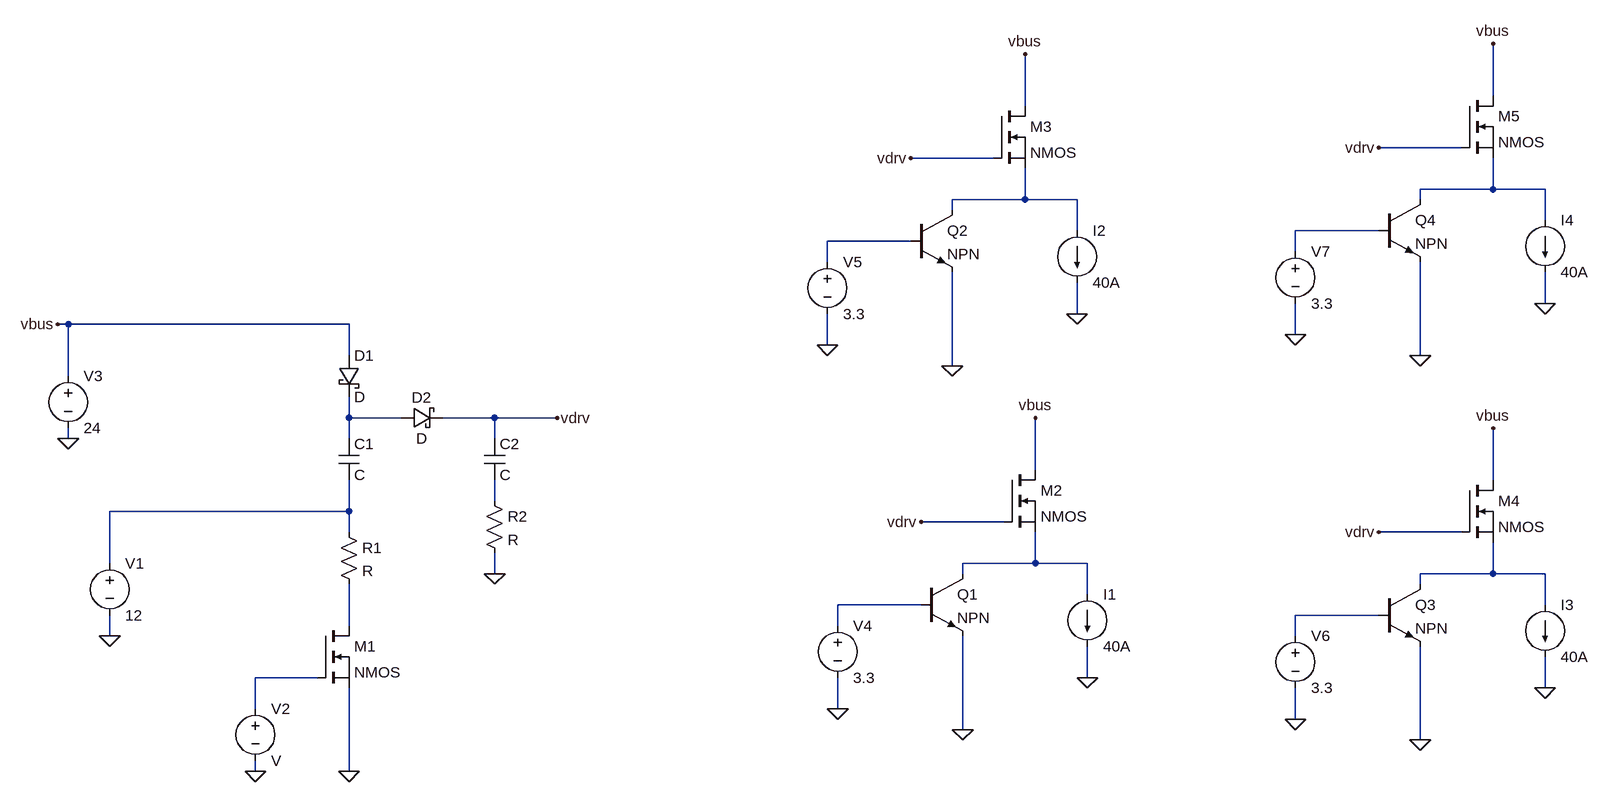
[diagram p0: schematic full_sim.asc]
full_sim.asc, the LTspice schematic file:
Version 4.1
SHEET 1 2216 680
WIRE 2064 -656 2064 -736
WIRE 1344 -640 1344 -720
WIRE 2016 -576 1888 -576
WIRE 1296 -560 1168 -560
WIRE 2064 -512 2064 -560
WIRE 2064 -512 1952 -512
WIRE 2144 -512 2064 -512
WIRE 1344 -496 1344 -544
WIRE 1344 -496 1232 -496
WIRE 1424 -496 1344 -496
WIRE 1952 -496 1952 -512
WIRE 1232 -480 1232 -496
WIRE 2144 -464 2144 -512
WIRE 1424 -448 1424 -496
WIRE 1888 -448 1760 -448
WIRE 1168 -432 1040 -432
WIRE 1760 -416 1760 -448
WIRE 1040 -400 1040 -432
WIRE 2144 -336 2144 -384
WIRE 1424 -320 1424 -368
WIRE -128 -304 -144 -304
WIRE 304 -304 -128 -304
WIRE 1760 -288 1760 -336
WIRE 1040 -272 1040 -320
WIRE 304 -256 304 -304
WIRE 1952 -256 1952 -400
WIRE 1232 -240 1232 -384
WIRE -128 -224 -128 -304
WIRE 304 -160 304 -192
WIRE 384 -160 304 -160
WIRE 528 -160 448 -160
WIRE 624 -160 528 -160
WIRE -128 -128 -128 -144
WIRE 304 -128 304 -160
WIRE 528 -128 528 -160
WIRE 1360 -80 1360 -160
WIRE 2064 -64 2064 -144
WIRE 528 -32 528 -64
WIRE 304 -16 304 -64
WIRE 304 -16 -64 -16
WIRE 1312 0 1184 0
WIRE 304 16 304 -16
WIRE 2016 16 1888 16
WIRE -64 64 -64 -16
WIRE 1360 64 1360 16
WIRE 1360 64 1248 64
WIRE 1440 64 1360 64
WIRE 528 80 528 48
WIRE 1248 80 1248 64
WIRE 2064 80 2064 32
WIRE 2064 80 1952 80
WIRE 2144 80 2064 80
WIRE 1952 96 1952 80
WIRE 1440 112 1440 64
WIRE 1184 128 1056 128
WIRE 2144 128 2144 80
WIRE 1888 144 1760 144
WIRE 304 160 304 96
WIRE 1056 160 1056 128
WIRE -64 176 -64 144
WIRE 1760 176 1760 144
WIRE 256 240 160 240
WIRE 1440 240 1440 192
WIRE 2144 256 2144 208
WIRE 160 288 160 240
WIRE 1056 288 1056 240
WIRE 1760 304 1760 256
WIRE 1248 320 1248 176
WIRE 1952 336 1952 192
WIRE 160 384 160 368
WIRE 304 384 304 256
FLAG -64 176 0
FLAG 160 384 0
FLAG 304 384 0
FLAG -128 -128 0
FLAG 528 80 0
FLAG 624 -160 vdrv
FLAG -144 -304 vbus
FLAG 1360 -160 vbus
FLAG 1056 288 0
FLAG 1248 320 0
FLAG 1184 0 vdrv
FLAG 1440 240 0
FLAG 1344 -720 vbus
FLAG 1040 -272 0
FLAG 1232 -240 0
FLAG 1168 -560 vdrv
FLAG 1424 -320 0
FLAG 2064 -144 vbus
FLAG 1760 304 0
FLAG 1952 336 0
FLAG 1888 16 vdrv
FLAG 2144 256 0
FLAG 2064 -736 vbus
FLAG 1760 -288 0
FLAG 1952 -256 0
FLAG 1888 -576 vdrv
FLAG 2144 -336 0
SYMBOL voltage -64 48 R0
WINDOW 123 0 0 Left 0
WINDOW 39 0 0 Left 0
SYMATTR InstName V1
SYMATTR Value 12
SYMBOL res 288 0 R0
SYMATTR InstName R1
SYMBOL nmos 256 160 R0
SYMATTR InstName M1
SYMBOL voltage 160 272 R0
SYMATTR InstName V2
SYMBOL cap 288 -128 R0
SYMATTR InstName C1
SYMBOL voltage -128 -240 R0
WINDOW 123 0 0 Left 0
WINDOW 39 0 0 Left 0
SYMATTR InstName V3
SYMATTR Value 24
SYMBOL schottky 288 -256 R0
SYMATTR InstName D1
SYMBOL schottky 384 -144 R270
WINDOW 0 32 32 VTop 2
WINDOW 3 0 32 VBottom 2
SYMATTR InstName D2
SYMBOL cap 512 -128 R0
SYMATTR InstName C2
SYMBOL res 512 -48 R0
SYMATTR InstName R2
SYMBOL nmos 1312 -80 R0
SYMATTR InstName M2
SYMBOL npn 1184 80 R0
SYMATTR InstName Q1
SYMBOL voltage 1056 144 R0
WINDOW 123 0 0 Left 0
WINDOW 39 0 0 Left 0
SYMATTR InstName V4
SYMATTR Value 3.3
SYMBOL current 1440 112 R0
WINDOW 123 0 0 Left 0
WINDOW 39 0 0 Left 0
SYMATTR InstName I1
SYMATTR Value 40A
SYMBOL nmos 1296 -640 R0
SYMATTR InstName M3
SYMBOL npn 1168 -480 R0
SYMATTR InstName Q2
SYMBOL voltage 1040 -416 R0
WINDOW 123 0 0 Left 0
WINDOW 39 0 0 Left 0
SYMATTR InstName V5
SYMATTR Value 3.3
SYMBOL current 1424 -448 R0
WINDOW 123 0 0 Left 0
WINDOW 39 0 0 Left 0
SYMATTR InstName I2
SYMATTR Value 40A
SYMBOL nmos 2016 -64 R0
SYMATTR InstName M4
SYMBOL npn 1888 96 R0
SYMATTR InstName Q3
SYMBOL voltage 1760 160 R0
WINDOW 123 0 0 Left 0
WINDOW 39 0 0 Left 0
SYMATTR InstName V6
SYMATTR Value 3.3
SYMBOL current 2144 128 R0
WINDOW 123 0 0 Left 0
WINDOW 39 0 0 Left 0
SYMATTR InstName I3
SYMATTR Value 40A
SYMBOL nmos 2016 -656 R0
SYMATTR InstName M5
SYMBOL npn 1888 -496 R0
SYMATTR InstName Q4
SYMBOL voltage 1760 -432 R0
WINDOW 123 0 0 Left 0
WINDOW 39 0 0 Left 0
SYMATTR InstName V7
SYMATTR Value 3.3
SYMBOL current 2144 -464 R0
WINDOW 123 0 0 Left 0
WINDOW 39 0 0 Left 0
SYMATTR InstName I4
SYMATTR Value 40A

The netlist it stands for:
* full_sim.asc
V1 N007 0 12
R1 N007 N012 R
M1 N012 N013 0 0 NMOS
V2 N013 0 V
C1 N005 N007 C
V3 vbus 0 24
D1 vbus N005 D
D2 N005 vdrv D
C2 vdrv N006 C
R2 N006 0 R
M2 vbus vdrv N008 N008 NMOS
Q1 N008 N010 0 0 NPN
V4 N010 0 3.3
I1 N008 0 40A
M3 vbus vdrv N002 N002 NMOS
Q2 N002 N004 0 0 NPN
V5 N004 0 3.3
I2 N002 0 40A
M4 vbus vdrv N009 N009 NMOS
Q3 N009 N011 0 0 NPN
V6 N011 0 3.3
I3 N009 0 40A
M5 vbus vdrv N001 N001 NMOS
Q4 N001 N003 0 0 NPN
V7 N003 0 3.3
I4 N001 0 40A
.model D D
.lib standard.dio
.model NPN NPN
.model PNP PNP
.lib standard.bjt
.model NMOS NMOS
.model PMOS PMOS
.lib standard.mos
.backanno
.end